# Altium schematic sheet BoardA-Input.SchDoc
size A; SheetNumber: 1; SheetTotal: 2; SPICEModelCacheRKNZGAWU: <root> / <DocumentId>RKNZGAWU</DocumentId> / <CacheFrame Number="0"> / <Model Name="umk107bj105_a-t" Kind="CKT"> / <Text>* UMK107BJ105_A-T     SPICE MODEL  ( General Type ) / *-------------------------------------------------------------------------------------------------------- / * Model Generated by TAIYO YUDEN Corporation (http://www.ty-top.com) / * Version 1.0 / * TAIYO YUDEN Control No. 170508_130520 / * Copyright(c) 2012 TAIYO YUDEN CO.,LTD. All Rights Reserved. / *-------------------------------------------------------------------------------------------------------- / * / * Products Name : Multilayer Ceramic Capacitors / * / * Characteristics : / *     Capacitance : 1 uF , Rated Voltage : 50V , TCC : X5R / *     Case Size : 1.6 x 0.8 / 0.063 x 0.031 [mm/inch] , Thickness : 0.8 / 0.031 [mm/inch] / *     (Conditions: Temperature = 25 degC , DC Bias Current/Voltage = 0A / 0V) / * / * Frequency Range : 40Hz - 3GHz / * / * External Node Assignments : / * / *  1  o---| |---o  2 / * / *-------------------------------------------------------------------------------------------------------- / .SubCkt UMK107BJ105_A-T 1 2 / **************************** / C0 1 110 0.79929u / Cm 1 101 0.13681u / C1 101 102 0.26224u / Rc1 101 102 5.8806k / C2 102 103 0.057839u / Rc2 102 103 469.42 / C3 103 110 0.014568u / Rc3 103 110 14.853 / C2m 1 301 0.13283u / C21 301 302 1.2593u / Rc21 301 302 6.3079k / C22 302 303 1.1189u / Rc22 302 303 6.9405k / C23 303 304 1.1421u / Rc23 303 304 6.4848k / C24 304 305 0.36861u / Rc24 304 305 785 / C25 305 306 0.39327u / Rc25 305 306 637.41 / C26 306 307 0.27451u / Rc26 306 307 19.365 / C27 307 308 0.15295u / Rc27 307 308 23.239 / C28 308 309 0.17569u / Rc28 308 309 17.788 / C29 309 110 1420.6p / Rc29 309 110 1.9725 / Rp0 1 110 500Meg / L0 110 120 0.24088n / Lm 120 130 0.1369n / L1 120 121 0.1842n / RL1 121 130 0.29804 / L2 120 122 0.40657n / RL2 122 130 0.57395 / L3 120 123 0.85773n / RL3 123 130 0.82282 / CR 120 124 0.11463u / LR 124 125 0.25983n / RR 125 130 52.447m / CL 130 140 1.4637p / LL 130 140 0.23986n / RL 130 140 33.985 / Rs 140 2 6.8539m / **************************** / .ends UMK107BJ105_A-T</Text> / </Model> / </CacheFrame> / </root>
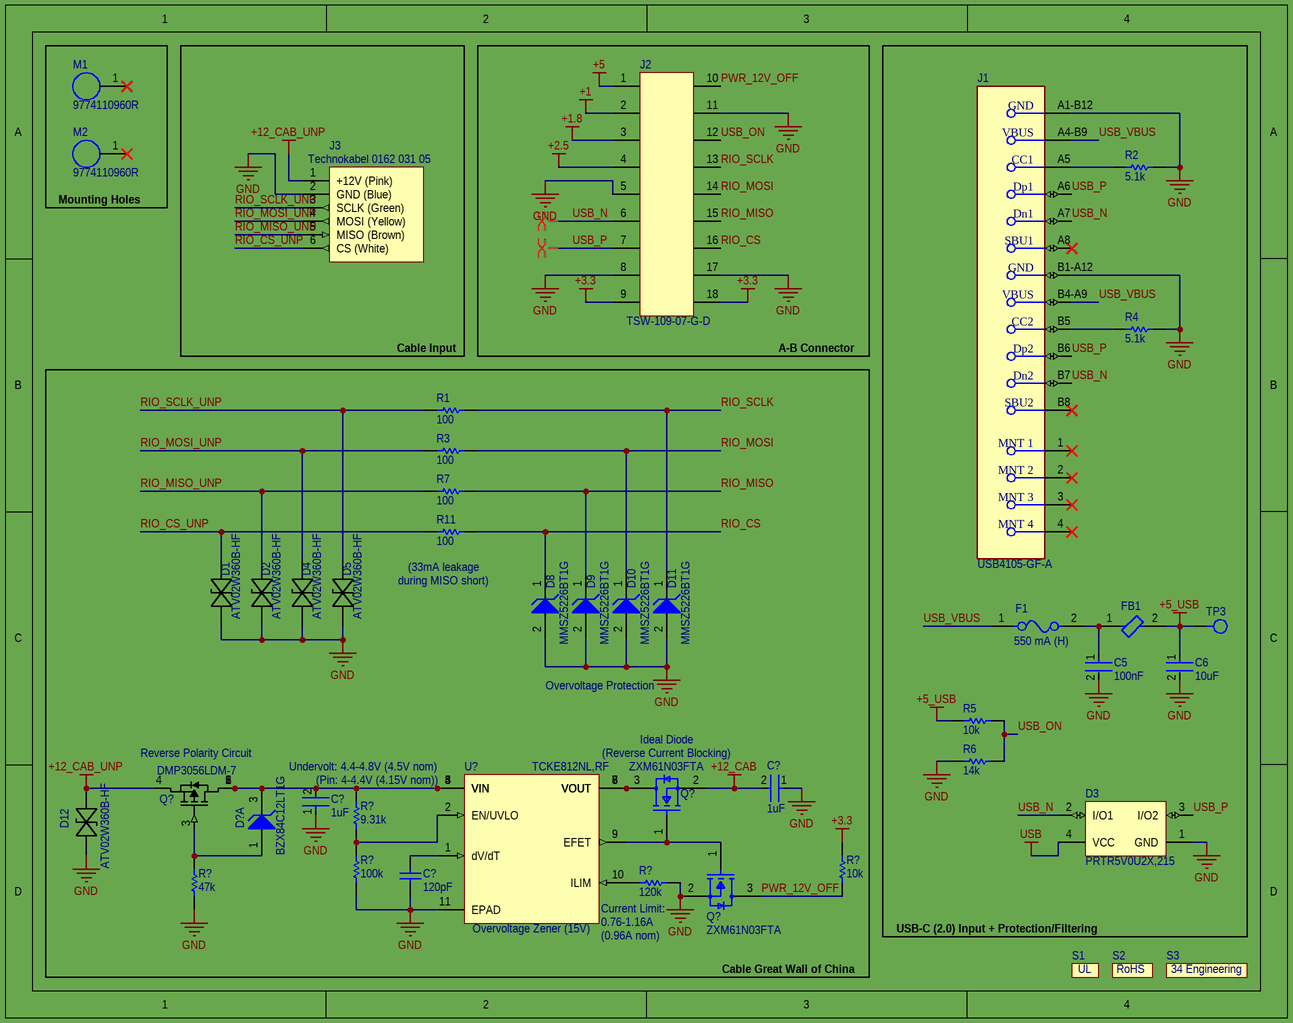
[diagram p0: BoardA-Input.SchDoc]

## Parts
(Parts that share a designator on the sheet are numbered #1, #2 ... from top to bottom, then left to right.)
C5  100nF  [FP-CGA3E-0_3-0_1-IPC_C]
C6  10uF  [FP-GRM188-0_2-MFG]
C?#1  1uF  [FP-0603-L_1_6_0_1-W_0_8_0-IPC_A]
C?#2  1uF  [FP-0603-L_1_6_0_1-W_0_8_0-IPC_A]
C?#3  120pF  [CAPC1608X87X35LL15T15]
D1  ATV02W360B-HF  [ATV02W]
D2  ATV02W360B-HF  [ATV02W]
D3  PRTR5V0U2X,215  [NXP-SOT143B-4_V]
D4  ATV02W360B-HF  [ATV02W]
D5  ATV02W360B-HF  [ATV02W]
D8  MMSZ5226BT1G  [ONSC-SOD-123-2-425-04_V]
D9  MMSZ5226BT1G  [ONSC-SOD-123-2-425-04_V]
D10  MMSZ5226BT1G  [ONSC-SOD-123-2-425-04_V]
D11  MMSZ5226BT1G  [ONSC-SOD-123-2-425-04_V]
D12  ATV02W360B-HF  [ATV02W]
D?  BZX84C12LT1G  [ONSC-SOT-23-3-318-08_V]  (part A of 2)
F1  550 mA (H)  [FP-MF-SMDF-MFG]
FB1  BLM15AG100SN1D  [FP-BLM15-0_05-IPC_A]  (value not drawn)
J1  USB4105-GF-A  [FP-USB4105-GF-A-MFG]
J2  TSW-109-07-G-D  [TSW-109-07-G-D]
J3  Technokabel 0162 031 05  [Technokabel 0162 031 05]
M1  9774110960R  [9774110960R]
M2  9774110960R  [9774110960R]
Q?#1  DMP3056LDM-7  [SOT95P285X130-6N]
Q?#2  ZXM61N03FTA  [FP-SOT23-MFG]
Q?#3  ZXM61N03FTA  [FP-SOT23-MFG]
R1  100  [RESC3225X70X50NL20T20]
R2  5.1k  [RESC1608X55X30NL15T15]
R3  100  [RESC3225X70X50NL20T20]
R4  5.1k  [RESC1608X55X30NL15T15]
R5  10k  [RESC1609X55X30LL15T15]
R6  14k  [RESC1608X55X30ML15T15]
R7  100  [RESC3225X70X50NL20T20]
R11  100  [RESC3225X70X50NL20T20]
R?#1  9.31k  [RESC1608X55X30LL15T15]
R?#2  10k  [RESC1609X55X30LL15T15]
R?#3  100k  [RESC1608X55X30ML20T20]
R?#4  120k  [RESC1609X55X30ML15T15]
R?#5  47k  [RESC1608X55X30NL15T15]
S1  (no value)  [UL]
S2  (no value)  [RoHS]
S3  (no value)  [34EngineeringLogo]
TP3  (no value)  [TestPoint1mm]
U?  TCKE812NL,RF  [WSON10B_TOS]

## Blocks framed on the sheet
Mounting Holes: M1 M2
Cable Input: J3
A-B Connector: J2
USB-C (2.0) Input + Protection/Filtering: C5 C6 D3 F1 FB1 J1 R2 R4-R6 TP3

## Nets
+1: J2.2
+1.8: J2.3
+2.5: J2.4
+3.3: J2.9 J2.18 R?#2.1
+5: J2.1
+5_USB: C6.1 FB1.2 R5.2 TP3.1
+12_CAB: C?#1.2 Q?#2.2(S)
+12_CAB_UNP: D12.2 J3.1(+12V_(Pink)) Q?#1.4
GND: C5.2 C6.2 C?#1.1 C?#2.1 C?#3.1 D1.2 D2.2 D3.1(GND) D4.2 D5.2 D8.2(A) D9.2(A) D10.2(A) D11.2(A) D12.1 J1.A1-B12(GND) J1.B1-A12(GND) J2.5 J2.8 J2.11 J2.17 J3.2(GND_(Blue)) Q?#3.2(S) R2.2 R4.2 R6.1 R?#3.1 R?#4.2 R?#5.1 U?.11(EPAD)
USB: D3.4(VCC)
PWR_12V_OFF: J2.10 Q?#3.3(D) R?#2.2
RIO_CS: D8.1(K) J2.16 R11.2
RIO_CS_UNP: D1.1 J3.6(CS_(White)) R11.1
RIO_MISO: D9.1(K) J2.15 R7.2
RIO_MISO_UNP: D2.1 J3.5(MISO_(Brown)) R7.1
RIO_MOSI: D10.1(K) J2.14 R3.2
RIO_MOSI_UNP: D4.1 J3.4(MOSI_(Yellow)) R3.1
RIO_SCLK: D11.1(K) J2.13 R1.2
RIO_SCLK_UNP: D5.1 J3.3(SCLK_(Green)) R1.1
USB_N: D3.2(I/O1) J1.A7(Dn1) J1.B7(Dn2) J2.6
USB_ON: J2.12 R5.1 R6.2
USB_P: D3.3(I/O2) J1.A6(Dp1) J1.B6(Dp2) J2.7
USB_VBUS: F1.1 J1.A4-B9(VBUS) J1.B4-A9(VBUS)
NetC5_1: C5.1 F1.2 FB1.1
NetC?#2_2: C?#2.2 D?.3(K) Q?#1.1 Q?#1.2 Q?#1.5 Q?#1.6 R?#1.2 U?.3(VIN) U?.4(VIN) U?.5(VIN)
NetC?#3_2: C?#3.2 U?.1(dV/dT)
NetD?_1: D?.1(A) Q?#1.3 R?#5.2
NetJ1_A5: J1.A5(CC1) R2.1
NetJ1_B5: J1.B5(CC2) R4.1
NetQ?#2_1: Q?#2.1(G) Q?#3.1(G) U?.9(EFET)
NetQ?#2_3: Q?#2.3(D) U?.6(VOUT) U?.7(VOUT) U?.8(VOUT)
NetR?#1_1: R?#1.1 R?#3.2 U?.2(EN/UVLO)
NetR?#4_1: R?#4.1 U?.10(ILIM)

Not connected (* = marked no-connect by the designer): J1 1(MNT_1)* 2(MNT_2)* 3(MNT_3)* 4(MNT_4)* A8(SBU1)* B8(SBU2)*; M1 1*; M2 1*

## Layout directives
differential pair; differential pair class USB: USB_N, USB_P

## Notes on the sheet
- (near R11) (33mA leakage during MISO short)
- Overvoltage Protection
- (near Q?#1) Reverse Polarity Circuit
- Undervolt: 4.4-4.8V (4.5V nom)
- Ideal Diode
- (Reverse Current Blocking)
- (near U?) (Pin: 4-4.4V (4.15V nom))
- (near U?) Overvoltage Zener (15V)
- (near U?) Current Limit:
  0.76-1.16A
  (0.96A nom)
- Cable Great Wall of China
- (in symbol 34EngineeringLogo) 34 Engineering

## Library data of the parts
C5 = CMP-2000-07546-2: Cap Ceramic 100nF 50V X7R 10% Pad SMD 0603 +125°C Automotive T/R; Weight: 7.1E-05oz; Composition: Ceramic; Max Operating Temperature: 125°C; Termination: SMD/SMT; Dielectric: X7R; Length: 1.6mm; Package Quantity: 1; REACH SVHC: No SVHC; Lead Free: Lead Free; Case Code (Metric): 1608; Min Operating Temperature: -55°C; Packaging: Tape and Reel; Tolerance: 10%; Voltage Rating: 50V; Case Code (Imperial): 0603; Capacitance: 100nF; Case/Package: 0603; Voltage Rating (DC): 50V; Depth: 0.8mm; Radiation Hardening: No; Ratings: AEC-Q200; Mount: Surface Mount; Voltage: 50V; Thickness: 0.035inch; Width: 0.8mm; Height: 0.8mm
C6 = CMP-2006-02520-2: Chip Multilayer Ceramic Capacitors for General Purpose, 0603, 10uF, X5R, 15%, 20%, 25V; Tolerance: 20%; Resistor Type: Ceramic; Voltage: 25V; Max Operating Temperature: 85°C; Min Operating Temperature: -55°C; Capacitance: 10uF; Dielectric: X5R; Lead Free: Lead Free; REACH SVHC: No SVHC; Case/Package: 0603; Mount: Surface Mount; Voltage Rating (DC): 25V; Height: 0.8mm; Length: 1.6mm; Thickness: 0.031inch; Width: 0.031inch; Termination: SMD/SMT; Case Code (Imperial): 0603; Case Code (Metric): 1608; Package Quantity: 1; Packaging: Tape and Reel; Depth: 0.8mm; Voltage Rating: 25V; Weight: 0.000222oz; Number of Pins: 2
C?#1 C?#2 = CMP-2000-05447-3: None; Tolerance: 10%; Voltage Rating: 50V; Dielectric: X5R; Height: 0.8mm; Depth: 0.8mm; Number of Pins: 2; Length: 1.6mm; Thickness: 0.035inch; Contact Plating: Nickel; Radiation Hardening: No; Package Quantity: 1; Case/Package: 0603; Capacitance: 1uF; Halogen Free: Halogen Free; RoHS Compliant: Yes; Termination: SMD/SMT; Max Operating Temperature: 85°C; Min Operating Temperature: -55°C; Case Code (Metric): 1608; Construction: Flat; Voltage Rating (DC): 50V; Packaging: Tape and Reel; Series: M; Case Code (Imperial): 0603; Width: 0.031inch; Mount: Surface Mount
C?#3 = CMP-2006-03074-1: Manufacturer: Kemet; Part Number: C0603C121J5GACTU
D1 D2 D4 D5 D12 = ATV02W360B-HF: No Description Available; Mfr_Name: Comchip; Type: DEV; Copyright: Copyright (C) 2022 Ultra Librarian. All rights reserved.; Manufacturer_Part_Number: ATV02W360B-HF; RefDes: RefDes
D3 = CMP-2000-05285-1: Ultra Low Capacitance Double Rail-to-Rail ESD Protection Diode, 5.5 V, 1 pF, -40 to 85 degC, 4-Pin SOT143B, RoHS, Tape and Reel; Manufacturer: NXP Semiconductors; Capacitance Value: 16pF; Number of Elements: 1; Rad Hardened: No; Reverse Breakdown Voltage: 6V; Working Voltage (Max): 5.5V; Polarity: Uni-Directional; Configuration: Quad; Leakage Current: 0.1uA; Product Height (mm): 1mm; Suppressor Type: DiodeArrays; Product Length (mm): 3mm; Product Depth (mm): 1.4mm; ESD Protection Voltage: 8KV@ContactDisc; Package Type: SOT; Mounting: SurfaceMount; Packaging: TapeandReel; Datasheet Version: Rev. 02, 01/2008; Reverse Stand-off Voltage: 5.5V; Manufacturer URL: http://www.nxp.com/; Operating Temp Range: -40Cto85C; Operating Temperature Classification: Industrial; Working Voltage: 5.5V; Operating Temperature Min Deg. C: -40C; Datasheet URL: https://datasheet.ciiva.com/4479/prtr5v0u2x-102853-4479461.pdf; Leakage Current (Max): 0.1uA; Direction Type: Uni-Directional; Pin Count: 3+Tab; Operating Temperature Max Deg. C: 85C; Mounting Style: SurfaceMount; Package / Case: SOT
D8-D11 = CMP-1060-00363-1: Zener Voltage Regulator, 500 mW, 2-Pin SOD-123, Pb-Free, Tape and Reel; Manufacturer: On Semiconductor; P Max (W): 0.5; VZ Typ (V): 3.3; PartNumber: MMSZ5226BT1G; ComponentLink1Description: Manufacturer URL; ComponentLink3URL: http://www.onsemi.com/pub_link/Collateral/425-04.PDF; ComponentLink3Description: Package Specification; ComponentLink2Description: Datasheet; ComponentLink1URL: http://www.onsemi.com/; Mounting Technology: Surface Mount; Packing: Tape and Reel; PackageDescription: 2-Pin SOD, Body 1.6 x 2.69 mm; ComponentLink2URL: http://www.onsemi.com/pub_link/Collateral/MMSZ5221BT1-D.PDF; RoHS: Pb-Free; PackageVersion: Rev. G, 10/2009; PackageReference: SOD-123-2-425-04; DatasheetVersion: Rev. 12
D? = CMP-1060-00857-1: Zener Voltage Regulator, 225 mW, 3-Pin SOT-23, Pb-Free, Tape and Reel; Manufacturer: On Semiconductor; PackageDescription: 3-Pin Small Outline Transistor, Body 2.92 x 1.3 mm, Pitch 0.95 mm; ComponentLink1URL: http://www.onsemi.com/; ComponentLink3URL: http://www.onsemi.cn/pub_link/Collateral/318-08.PDF; Mounting Technology: Surface Mount; PartNumber: BZX84C12LT1G; ComponentLink3Description: Package Specification; RoHS: Pb-Free; DatasheetVersion: Rev. 17; ComponentLink2URL: http://www.onsemi.com/pub_link/Collateral/BZX84C2V4LT1-D.PDF; ComponentLink2Description: Datasheet; ComponentLink1Description: Manufacturer URL; Packing: Tape and Reel; PackageReference: SOT-23-3-318-08; PackageVersion: Rev. AP, 11/2009
F1 = CMP-07400-000008-1: PTC RESET FUSE 60V 550MA 2018; Manufacturer Part Number: MF-SMDF050-2; Manufacturer: Bourns Inc.; Trip Current: 1.2A; Resistance: 0.2-1Ω; Trip Time: 3s; Current Rating: 10A; Value: 0.2-1Ω; Hold Current: 0.55A; ComponentLink2Description: Datasheet; Device Class L2: PTC Resettable Fuses; Temperature Range Low: -40°C; Temperature: -40°C to +85°C; RoHS: TRUE; Package: MF-SMDF; Digikey Description: PTC RESET FUSE 60V 550MA 2018; Device Class L3: unset; Octopart: https://octopart.com/mf-smdf050-2-bourns-94955; Mouser Description: Resettable Fuses - PPTC 0.55A 60V 0.2ohm Hold 0.55A Trip1.2a; Category: Fuse; Height: 1.09mm; Temperature Range High: +85°C; Voltage Rating: 60V; Device Class L1: Circuit Protection; Ambient Temperature Range Low: -40°C; Automotive: No; Lead Free: Yes; ComponentLink2URL: https://bourns.com/data/global/pdfs/MFSMDF.pdf; Ambient Temperature Range High: +85°C
FB1 = CMP-0686-00176-4: Chip Ferrite Bead, 0402, 10Ω @ 100MHz, 0.025Ω, 25%, 1A; Number of Circuits: 1; DC Resistance (DCR): 25mR; Shielding: Unshielded; Resistance: 50mR; Impedance: 10R; Max Current Rating: 1A; Length: 1mm; Min Operating Temperature: -55°C; Case Code (Imperial): 0402; Current Rating: 1A; Termination: SMD/SMT; Test Frequency: 100MHz; Depth: 0.55mm; Package Quantity: 1; Packaging: Tape and Reel; Height: 0.5mm; Max DC Current: 1A; DC Current: 1A; RoHS Compliant: Yes; Resistor Type: Ferrite Bead; Tolerance: 25%; Number of Lines: 1; Lead Free: Lead Free; Max Operating Temperature: 125°C; Core Material: Ferrite; Case Code (Metric): 1005; REACH SVHC: No SVHC; Width: 0.5mm; Radiation Hardening: No; Number of Pins: 2; Material: Ferrite; Case/Package: 0402; Military Standard: Not; Weight: 2.3E-05oz
J1 = CMP-245163-000001-1: CONN RCPT USB2.0 TYPEC 5A; Manufacturer: GCT; Voltage Rating: 20V; Is Female: yes; Current Rating: 5/6.25/1.25/0.25A; Number Of Contacts: 16; Conn Orientation: Right Angle; Device Class L1: Connectors; Category: Conn; Lead Free: Yes; RoHS: TRUE; Temperature Range High: +85°C; Digikey Description: CONN RCPT USB2.0 TYPEC 5A; Device Class L3: unset; ComponentLink2Description: Datasheet; Manufacturer Part Number: USB4105-GF-A; Package: 0; Usb Standard: USB 2.0; Device Class L2: USB Connectors; Automotive: No; Temperature Range Low: -40°C; Height: 3.46mm; Temperature: -40°C to +85°C; Contact Material: Gold,Nickel; ComponentLink2URL: https://gct.co/files/drawings/usb4105.pdf; Octopart: https://octopart.com/usb4105-gf-a-gct-106627878
J2 = TSW-109-07-G-D: Conn Unshrouded Header HDR 18 POS 2.54mm Solder ST Thru-Hole; Manufacturer: Samtec; Number of Contacts: 18; Gender: Male; Max Current Rating: 7.6A; Max Voltage Rating (AC): 550V; Connector Type: Male Pin; Row Spacing: 0.1inch; Supplier 1: Digi-Key; Manufacturer Part Number: TSW-109-07-G-D; RoHS: Yes; Category: Connectors; Stock 1: 676; Pricing 1: 1=1.81000, 10=1.64100, 25=1.54000, 50=1.47320, 100=1.40620, 250=1.27224, 500=1.17180 (USD); Mount: Through Hole; Contact Plating: Gold; Contact Material: Bronze; Housing Color: Black; Housing Material: Polyester; Color: Black; Min Operating Temperature: -55°C; Max Operating Temperature: 125°C; Number of Rows: 2; Termination: Solder; Packaging: Bulk; Series: TSW; Orientation: Straight; Number of Positions: 18; Contact Type: Male Pin; Length: 22.86mm; Width: 5.08mm; Pitch: 2.54mm; Depth: 5.08mm; Contact Mating Length: 0.23inch; Radiation Hardening: No; RoHS Compliant: Yes; Lead Free: Lead Free; REACH SVHC: No SVHC; ComponentLink1URL: https://datasheet.ciiva.com/10198/htsw-th-10198345.pdf?src-supplier=Avnet; ComponentLink1Description: https://datasheet.ciiva.com/10198/htsw-th-10198345.pdf?src-supplier=Avnet; ComponentLink2URL: https://datasheet.ciiva.com/16701/htsw-th-16701221.pdf?src-supplier=Avnet+Europe; ComponentLink2Description: https://datasheet.ciiva.com/16701/htsw-th-16701221.pdf?src-supplier=Avnet+Europe; Supplier Part Number 1: SAM1028-09-ND
M1 M2 = 9774110960R: WURTH ELEKTRONIK         9774110960R             Spacer, SMT, Swage Round, Steel, 6x11mm; Manufacturer: Wurth Electronics; Manufacturer Part Number: 9774070960R; Plating: Tin; Threaded/Unthreaded: Unthreaded; Inside Diameter: 0.13inch; Outside Diameter: 0.236inch; RoHS: Yes; Category: Spacers, Standoffs; Stock 1: 8947; Pricing 1: 1=1.73000, 10=1.65800, 50=1.45600, 100=1.35500 (USD); Material: Steel; Length: 0.33inch; REACH SVHC: Unknown; ComponentLink1URL: http://www.mouser.com/ds/2/445/9774070960R-611130.pdf?src-supplier=Mouser; ComponentLink1Description: http://www.mouser.com/ds/2/445/9774070960R-611130.pdf?src-supplier=Mouser; ComponentLink2URL: http://www.farnell.com/datasheets/1960400.pdf?src-supplier=Farnell; ComponentLink2Description: http://www.farnell.com/datasheets/1960400.pdf?src-supplier=Farnell; ComponentLink3URL: https://media.digikey.com/pdf/Data%20Sheets/Wurth%20Electronics%20PDFs/WA-SMSx_Performance_Flyer.pdf?src-supplier=Digi-Key; ComponentLink3Description: https://media.digikey.com/pdf/Data%20Sheets/Wurth%20Electronics%20PDFs/WA-SMSx_Performance_Flyer.pdf?src-supplier=Digi-Key; ComponentLink4URL: http://www.farnell.com/datasheets/1960400.pdf?src-supplier=Newark; ComponentLink4Description: http://www.farnell.com/datasheets/1960400.pdf?src-supplier=Newark; ComponentLink5URL: http://www.farnell.com/datasheets/1960400.pdf?src-supplier=Element14; ComponentLink5Description: http://www.farnell.com/datasheets/1960400.pdf?src-supplier=Element14; Stock 2: 2072; Pricing 2: 1=2.14000, 10=2.05100, 50=1.79700, 100=1.66900 (USD); ComponentLink6URL: http://www.mouser.com/ds/2/445/9774110960R-611133.pdf?src-supplier=Mouser; ComponentLink6Description: http://www.mouser.com/ds/2/445/9774110960R-611133.pdf?src-supplier=Mouser; ComponentLink7URL: http://www.farnell.com/datasheets/1960407.pdf?src-supplier=Farnell; ComponentLink7Description: http://www.farnell.com/datasheets/1960407.pdf?src-supplier=Farnell; ComponentLink8URL: http://www.farnell.com/datasheets/1960407.pdf?src-supplier=Element14; ComponentLink8Description: http://www.farnell.com/datasheets/1960407.pdf?src-supplier=Element14; Supplier 1: Digi-Key
Q?#1 = DMP3056LDM-7: Trans Mosfet P-ch 30V 4.3A 6-PIN SOT-26 T/r / Mosfet P-ch 30V 4.3A SOT-26; Mfr_Name: Diodes Inc; Manufacturer_Part_Number: DMG4407SSS-13; Manufacturer: Diodes; Type: DEV; Rise Time: 6.6ns; Fall Time: 22.3ns; Turn-Off Delay Time: 50.1ns; Turn-On Delay Time: 10.2ns; Gate to Source Voltage (Vgs): 10V; Rds On Max: 45mR; Input Capacitance: 948pF; Number of Elements: 1; Max Power Dissipation: 1.5W; Drain to Source Breakdown Voltage: -30V; Element Configuration: Single; Polarity: P-CHANNEL; Copyright: Copyright (C) 2022 Ultra Librarian. All rights reserved.; RefDes: RefDes; Supplier 1: Arrow Electronics; Manufacturer Part Number: DMP3056LDM-7; RoHS: Yes; Category: MOSFETs; Stock 1: 366; Pricing 1: 1=0.31620, 10=0.31310, 25=0.30990, 100=0.23530, 250=0.23300, 500=0.20610, 1000=0.19360, 3000=0.17330 (USD); Mount: Surface Mount; Case/Package: SOT-26-6; Number of Pins: 6; Weight: 0.000529oz; Min Operating Temperature: -55°C; Max Operating Temperature: 150°C; Continuous Drain Current (ID): 4.3A; Package Quantity: 3000; Packaging: Cut Tape; Drain to Source Voltage (Vdss): 30V; Power Dissipation: 1.5W; Drain to Source Resistance: 45mR; Number of Channels: 1; Series: DMP3056; Length: 3mm; Width: 1.6mm; Height: 1.1mm; Radiation Hardening: No; REACH SVHC: No SVHC; Lead Free: Lead Free; RoHS Compliant: Yes; ComponentLink1URL: https://datasheet.ciiva.com/935/ds31449-935056.pdf?src-supplier=Digi-Key; ComponentLink1Description: https://datasheet.ciiva.com/935/ds31449-935056.pdf?src-supplier=Digi-Key; ComponentLink2URL: https://datasheet.ciiva.com/935/ds31449-935055.pdf?src-supplier=Digi-Key; ComponentLink2Description: https://datasheet.ciiva.com/935/ds31449-935055.pdf?src-supplier=Digi-Key; ComponentLink3URL: https://datasheet.ciiva.com/935/ds31449-935057.pdf?src-supplier=Digi-Key; ComponentLink3Description: https://datasheet.ciiva.com/935/ds31449-935057.pdf?src-supplier=Digi-Key; ComponentLink4URL: https://datasheet.ciiva.com/11176/ds31449-11176470.pdf?src-supplier=Avnet; ComponentLink4Description: https://datasheet.ciiva.com/11176/ds31449-11176470.pdf?src-supplier=Avnet; ComponentLink5URL: https://datasheet.ciiva.com/8115/ds31449-8115483.pdf?src-supplier=Avnet; ComponentLink5Description: https://datasheet.ciiva.com/8115/ds31449-8115483.pdf?src-supplier=Avnet; Supplier Part Number 1: DMP3056LDM-7
Q?#2 Q?#3 = CMP-12801-000012-1: MOSFET N-CH 30V 1.4A SOT23-3; Manufacturer: Diodes Inc.; Power Dissipation: 625mW; Reverse Recovery Time: 11ns; Standoff Height: 0.013mm; Number Of Channels: 1; Depletion Mode: False; Gate To Source Voltage: 20V; Turn On Delay Time: 1.9ns; Drain To Source Resistance: 0.22Ω; Max Forward Diode Voltage: 0.95V; Gate Charge At Vgs: 4.1nC @ 10V; Threshold Vgs Min: 1V; Pulse Drain Current: 7.3A; Max Junction Temp: +150°C; Turn Off Delay Time: 5.8ns; Reverse Recovery Charge: 3.5nC; Input Capacitace At Vds: 150pF @ 25V; Rthja Max: 200°C/W; ComponentLink2Description: Datasheet; Height: 1.1mm; Temperature Range Low: -55°C; Footprint Url: https://www.diodes.com/assets/Package-Files/SOT23.pdf; Device Class L2: Transistors; Drain To Source Voltage: 30V; ComponentLink2URL: https://www.diodes.com/assets/Datasheets/ZXM61N03F.pdf; Manufacturer Part Number: ZXM61N03FTA; Package: SOT23; Automotive: No; Temperature Range High: +150°C; Device Class L1: Discrete Semiconductors; Octopart: https://octopart.com/zxm61n03fta-diodes+inc.-660007; Lead Free: Yes; Mouser Description: MOSFET 30V N-Chnl HDMOS; Drain To Source Breakdown Voltage: 30V; Device Class L3: MOSFETs; Digikey Description: MOSFET N-CH 30V 1.4A SOT23-3; Continuous Drain Current: 1.4A; Number Of N Channels: 1; RoHS: TRUE; Temperature: -55°C to +150°C; Category: Trans
R1 R3 R7 R11 = CMP-2005-03643-1: Part Number: ERJ-P14J101U; Manufacturer: Panasonic
R2 R4 = CMP-2000-00540-1: Part Number: ERJ-3EKF5101V; Manufacturer: Panasonic
R5 R?#2 = CMP-1012-00623-3: Chip Resistor, 10 KOhm, +/- 1%, 0.1 W, -55 to 155 degC, 0603 (1608 Metric), RoHS, Tape and Reel; Manufacturer: Panasonic; Voltage Rating: 75V; Case\/Package: 0603; Power Rating: 100mW; Resistance: 10KOhm; Temperature Coefficient: 100ppm\/degreesC; Number of Pins: 2; Package Reference: 603; Depth: 0.8mm; Mount: SurfaceMount; Package Description: 2-Pin Surface Mount Device, Body 1.6 x 0.85 mm; Datasheet Version: 02/2017; Length: 1.6mm; Lead Free: LeadFree; Height: 0.45mm; Number of Terminations: 2; Max Power Dissipation: 100mW; Min Operating Temperature: -55degC; Datasheet URL: https://industrial.panasonic.com/cdbs/www-data/pdf/RDA0000/AOA0000C304.pdf; Termination: SMD/SMT; Case Code (Metric): 1608; Case Code (Imperial): 0603; Tolerance: 1%; Max Operating Temperature: 155degC; RoHSCompliant: true; Voltage Rating (DC): 75V; Radiation Hardening: No; Packaging: TapeandReel; Composition: ThickFilm; Mounting Technology: SurfaceMount; Manufacturer URL: http://www.panasonic.com/; Width: 0.031inch; REACH SVHC: NoSVHC; Contact Plating: Tin; Military Standard: Not; Package Quantity: 1
R6 = CMP-2000-00247-1: Part Number: ERJ-3EKF1402V; Manufacturer: Panasonic
R?#1 = CMP-2000-00689-1: Manufacturer: Panasonic; Part Number: ERJ-3EKF9311V
R?#3 = CMP-2000-00875-1: Part Number: ERA3AEB104V; Manufacturer: Panasonic
R?#4 = CMP-2000-00216-2: Chip Resistor, 120 KOhm, +/- 1%, 0.1 W, -55 to 155 degC, 0603 (1608 Metric), RoHS, Tape and Reel; Manufacturer: Panasonic; Voltage Rating (DC): 75V; Temperature Coefficient: 100ppm/degC; Max Power Dissipation: 100mW; Depth: 0.8mm; Min Operating Temperature: -55degC; Number of Terminations: 2; Case Code (Metric): 1608; Datasheet Version: 42095.0; Tolerance: 1%; Radiation Hardening: No; REACH SVHC: NoSVHC; Package Description: 2-Pin Surface Mount Device, Body 1.6 x 0.85 mm; Package URL: http://www.st.com/st-web-ui/static/active/en/resource/technical/document/datasheet/CD00001320.pdf; Number of Pins: 2; Height: 0.022inch; Voltage Rating: 75V; Datasheet URL: https://industrial.panasonic.com/cdbs/www-data/pdf/RDA0000/AOA0000C283.pdf; Composition: ThickFilm; Length: 1.6mm; Width: 0.8mm; Packaging: TapeandReel; Package Reference: 0603; Package Quantity: 1; Manufacturer URL: http://www.panasonic.com/; Mount: SurfaceMount; RoHSCompliant: True; Military Standard: Not; Contact Plating: Tin; Case/Package: 0603; Max Operating Temperature: 155degC; Resistance: 120KOhm; Power Rating: 100mW; Case Code (Imperial): 0603; Termination: SMD/SMT; Lead Free: LeadFree
R?#5 = CMP-2000-00523-2: Chip Resistor, 47 KOhm, +/- 1%, 0.1 W, -55 to 155 degC, 0603 (1608 Metric), RoHS, Tape and Reel; Case\Package: 0603; Forward Current: 20 mA; Power Rating: 90 mW; Illumination Colour: Red; Nominal Vf: 2.1 V; Viewing Angle: 160 degrees; Luminous Intensity: 63 mcd; Lens Style: Clear; Nominal Wavelength: 639 nm; Case Code (Imperial): 0603; Case Code (Metric): 1608; Packaging: Tape and Reel; Radiation Hardening: No; Colour: Red; PackageDescription: 2-Pin Surface Mount Device, Body 1.6 x 0.85 mm; ComponentLink1Description: Manufacturer URL; Width: 0.8 mm; DatasheetVersion: Apr-15; ComponentLink2URL: http://industrial.panasonic.com/cdbs/www-data/pdf/RDA0000/AOA0000C86.pdf; Min Operating Temperature: -40 degC; Height: 0.6 mm; Package Quantity: 3000; ComponentLink2Description: Datasheet; REACH SVHC: No SVHC; ComponentLink1URL: http://www.panasonic.com/; Mount: Surface Mount; RoHSCompliant: true; Max Operating Temperature: 100 degC; PackageReference: 0603; Length: 1.6 mm; Forward Voltage: 2.1 V; Pins: 2
S1 = UL
S2 = RoHS
S3 = 34EngineeringLogo: 34 Engineering Silkscreen Logo
TP3 = TestPoint1mm: Test Point 1mm Diameter
U? = TCKE812NL,RF: 5.1V Voltage Clmp Latch Type; Manufacturer: Toshiba; Manufacturer Part Number: TCKE812NLRF; Supplier 1: Digi-Key; RoHS: Yes; Supplier Part Number 1: 655L16112I2T-ND